# EAGLE schematic Receiver (EAGLE 6.5.0)
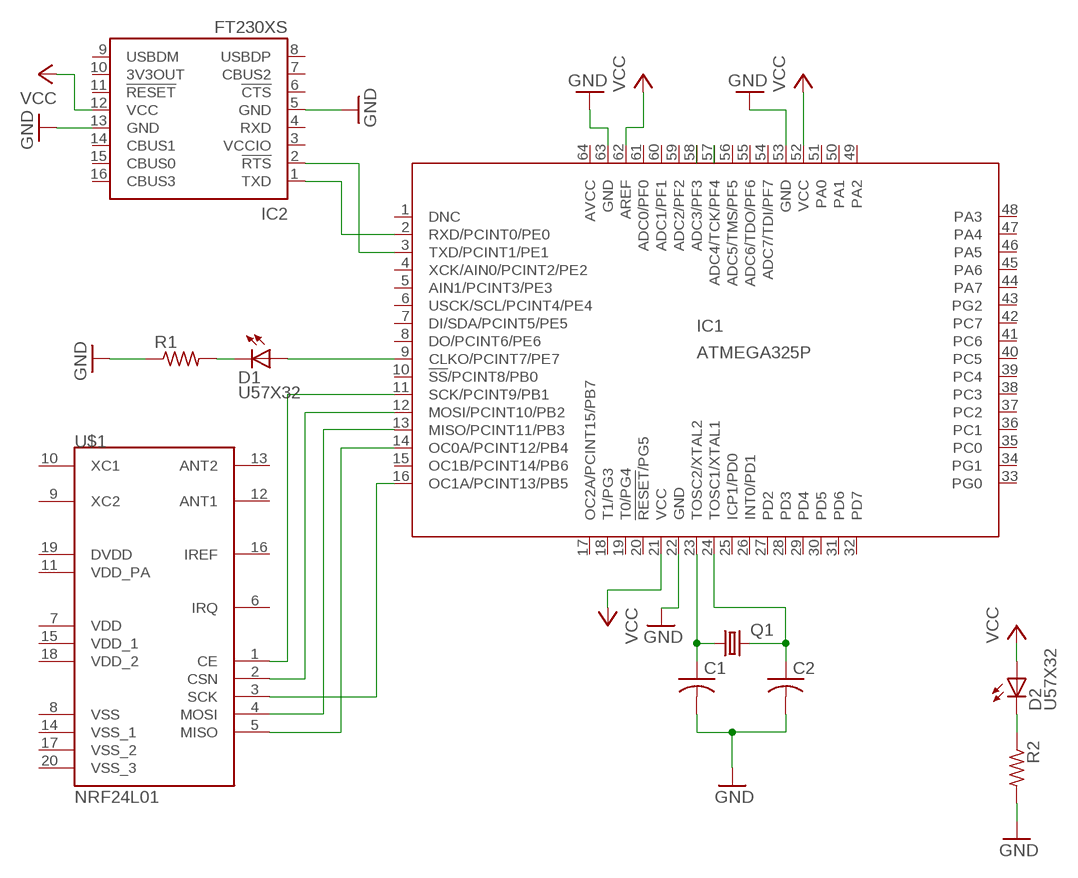
[diagram p0: schematic, sheet 1]

## Parts
C1  C-US025-024X044  [C025-024X044]
C2  C-US025-024X044  [C025-024X044]
D1  U57X32  [U57X32]
D2  U57X32  [U57X32]
IC1  ATMEGA325P  [64M1]
IC2  FT230XS  [SSOP16]
Q1  CRYSTALHC49S  [HC49/S]
R1  R-US_0204/5  [0204/5]
R2  R-US_0204/5  [0204/5]
U$1  NRF24L01  [QFN20]

## Nets
GND: C1.2 C2.2 IC1.22(GND) IC1.53(GND) IC1.63(GND) IC2.5(GND) IC2.13(GND) R1.1 R2.2
N$1: D1.A IC1.9(CLKO/PCINT7/PE7)
N$2: IC1.11(SCK/PCINT9/PB1) U$1.1(CE)
N$3: D2.K(C) R2.1
N$4: IC1.57(ADC4/TCK/PF4)
N$5: D1.K(C) R1.2
N$6: IC1.12(MOSI/PCINT10/PB2) U$1.2(CSN)
N$7: IC1.16(OC1A/PCINT13/PB5) U$1.3(SCK)
N$8: IC1.13(MISO/PCINT11/PB3) U$1.4(MOSI)
N$9: IC1.3(TXD/PCINT1/PE1) IC2.2(!RTS)
N$10: IC1.58(ADC3/PF3)
N$11: IC1.14(OC0A/PCINT12/PB4) U$1.5(MISO)
N$12: C1.1 IC1.23(TOSC2/XTAL2) Q1.1
N$13: IC1.2(RXD/PCINT0/PE0) IC2.1(TXD)
N$17: C2.1 IC1.24(TOSC1/XTAL1) Q1.2
VCC: D2.A IC1.21(VCC) IC1.52(VCC) IC1.62(AREF) IC2.12(VCC)
Unconnected: IC1.1(DNC) IC1.4(XCK/AIN0/PCINT2/PE2) IC1.5(AIN1/PCINT3/PE3) IC1.6(USCK/SCL/PCINT4/PE4) IC1.7(DI/SDA/PCINT5/PE5) IC1.8(DO/PCINT6/PE6) IC1.10(!SS!/PCINT8/PB0) IC1.15(OC1B/PCINT14/PB6) IC1.17(OC2A/PCINT15/PB7) IC1.18(T1/PG3) IC1.19(T0/PG4) IC1.20(!RESET!/PG5) IC1.25(ICP1/PD0) IC1.26(INT0/PD1) IC1.27(PD2) IC1.28(PD3) IC1.29(PD4) IC1.30(PD5) IC1.31(PD6) IC1.32(PD7) IC1.33(PG0) IC1.34(PG1) IC1.35(PC0) IC1.36(PC1) IC1.37(PC2) IC1.38(PC3) IC1.39(PC4) IC1.40(PC5) IC1.41(PC6) IC1.42(PC7) IC1.43(PG2) IC1.44(PA7) IC1.45(PA6) IC1.46(PA5) IC1.47(PA4) IC1.48(PA3) IC1.49(PA2) IC1.50(PA1) IC1.51(PA0) IC1.54(ADC7/TDI/PF7) IC1.55(ADC6/TDO/PF6) IC1.56(ADC5/TMS/PF5) IC1.59(ADC2/PF2) IC1.60(ADC1/PF1) IC1.61(ADC0/PF0) IC2.4(RXD) IC2.6(!CTS) IC2.7(CBUS2) IC2.8(USBDP) IC2.9(USBDM) IC2.10(3V3OUT) IC2.11(!RESET) IC2.14(CBUS1) IC2.15(CBUS0) IC2.16(CBUS3) U$1.6(IRQ) U$1.7(VDD) U$1.8(VSS) U$1.9(XC2) U$1.10(XC1) U$1.11(VDD_PA) U$1.12(ANT1) U$1.13(ANT2) U$1.14(VSS_1) U$1.15(VDD_1) U$1.16(IREF) U$1.17(VSS_2) U$1.18(VDD_2) U$1.19(DVDD) U$1.20(VSS_3)

## Power pins joined to a net without a drawn wire
AVCC: IC1.64(AVCC)
VCCIO: IC2.3(VCCIO)

## Library data of the parts
C1 C2 = resistor:C-US: CAPACITOR, American symbol
D1 D2 = led:U57X32: LED rectangle, 5.7 x 3.2 mm
IC1 = atmel:ATMEGA325P: 8-bit Microcontroller with 32K Bytes In-System Programmable Flash Source: http://www.atmel.com .. doc8023.pdf; MPN: ATMEGA325PV-10AU; OC_FARNELL: 1636939; OC_NEWARK: 03P2025
IC2 = ftdichip:FT230X: USB to BASIC UART IC Auto generated by make-symbol-device-package-bsdl.ulp Rev. 43 Source: Data sheet <http://www.ftdichip.com/Support/Documents/DataSheets/ICs/DS_FT230X.pdf>
Q1 = crystal:CRYSTAL: CRYSTAL; OC_FARNELL: 1667008; OC_NEWARK: unknown
R1 R2 = resistor:R-US_: RESISTOR, American symbol
U$1 = nrf24l01:NRF24L01: nRF24L01 Single chip 2.4GHz transceiver from Nordic Semiconductors.